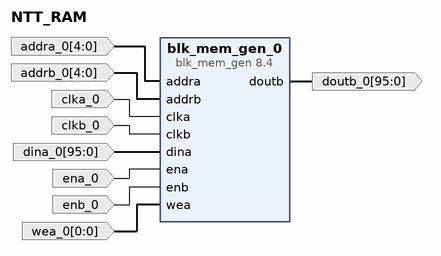
[diagram p0: block diagram of the top level]
# Vivado block design NTT_RAM, xczu7ev-ffvc1156-2-e, Vivado 2024.2
create_bd_design NTT_RAM

create_bd_port -dir I -from 4 -to 0 addra_0
create_bd_port -dir I -from 4 -to 0 addrb_0
create_bd_port -dir I -type clk clka_0
create_bd_port -dir I -type clk clkb_0
create_bd_port -dir I -from 95 -to 0 dina_0
create_bd_port -dir O -from 95 -to 0 doutb_0
create_bd_port -dir I ena_0
create_bd_port -dir I enb_0
create_bd_port -dir I -from 0 -to 0 wea_0

create_bd_cell -type ip -vlnv xilinx.com:ip:blk_mem_gen:8.4 blk_mem_gen_0
set_property -dict [list \
  CONFIG.Memory_Type Simple_Dual_Port_RAM \
  CONFIG.Operating_Mode_A WRITE_FIRST \
  CONFIG.PRIM_type_to_Implement URAM \
  CONFIG.Write_Depth_A 32 \
  CONFIG.Write_Width_A 96 \
  CONFIG.use_bram_block Stand_Alone \
] [get_bd_cells blk_mem_gen_0]

# ---- connections ----

connect_bd_net -net addra_0_1 [get_bd_ports addra_0] [get_bd_pins blk_mem_gen_0/addra]
connect_bd_net -net addrb_0_1 [get_bd_ports addrb_0] [get_bd_pins blk_mem_gen_0/addrb]
connect_bd_net [get_bd_pins blk_mem_gen_0/doutb] [get_bd_ports doutb_0]
connect_bd_net -net clka_0_1 [get_bd_ports clka_0] [get_bd_pins blk_mem_gen_0/clka]
connect_bd_net -net clkb_0_1 [get_bd_ports clkb_0] [get_bd_pins blk_mem_gen_0/clkb]
connect_bd_net -net dina_0_1 [get_bd_ports dina_0] [get_bd_pins blk_mem_gen_0/dina]
connect_bd_net -net ena_0_1 [get_bd_ports ena_0] [get_bd_pins blk_mem_gen_0/ena]
connect_bd_net -net enb_0_1 [get_bd_ports enb_0] [get_bd_pins blk_mem_gen_0/enb]
connect_bd_net -net wea_0_1 [get_bd_ports wea_0] [get_bd_pins blk_mem_gen_0/wea]

validate_bd_design
save_bd_design
